# EAGLE schematic SonarBoardV2 (EAGLE 7.2.0)
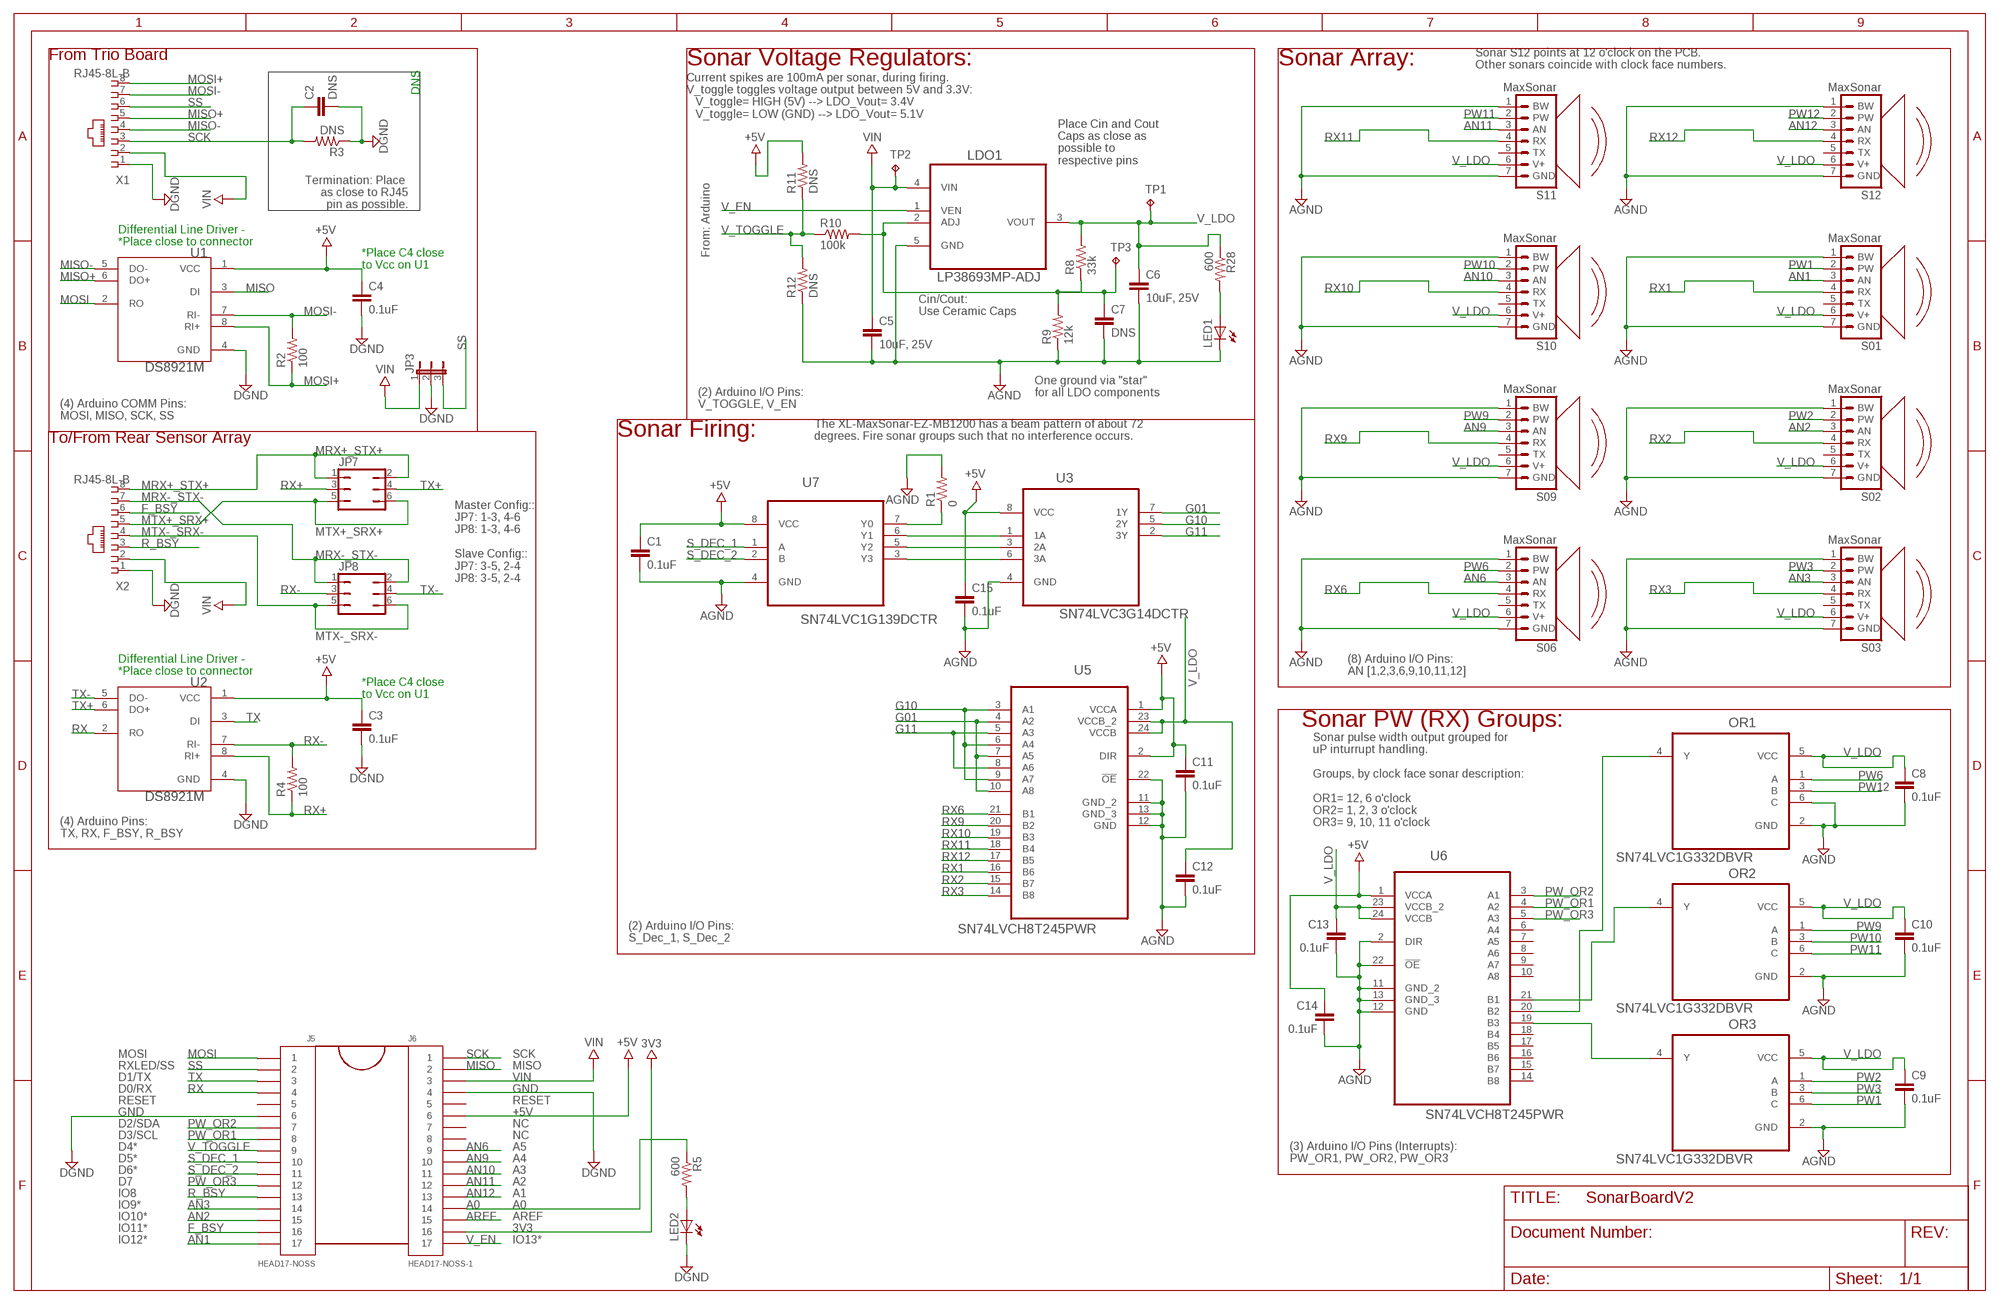
[diagram p0: schematic, sheet 1]

## Parts
C1  0.1uF  CAP0603-CAP  [0603-CAP]
C2  DNS  CAP0603-CAP  [0603-CAP]
C3  0.1uF  CAP0603-CAP  [0603-CAP]
C4  0.1uF  CAP0603-CAP  [0603-CAP]
C5  10uF, 25V  CAP0805  [0805]
C6  10uF, 25V  CAP0805  [0805]
C7  DNS  CAP0603-CAP  [0603-CAP]
C8  0.1uF  CAP0603-CAP  [0603-CAP]
C9  0.1uF  CAP0603-CAP  [0603-CAP]
C10  0.1uF  CAP0603-CAP  [0603-CAP]
C11  0.1uF  CAP0603-CAP  [0603-CAP]
C12  0.1uF  CAP0603-CAP  [0603-CAP]
C13  0.1uF  CAP0603-CAP  [0603-CAP]
C14  0.1uF  CAP0603-CAP  [0603-CAP]
C15  0.1uF  CAP0603-CAP  [0603-CAP]
J5  HEAD17-NOSS  [HEAD17-NOSS]
J6  HEAD17-NOSS-1  [HEAD17-NOSS-1]
JP3  JP2E  [JP2]
JP7  JP3Q  [JP3Q]
JP8  JP3Q  [JP3Q]
LDO1  LP38693MP-ADJ  [SOT150P696X180-5N]
LED1  LEDSML0603  [SML0603]
LED2  LEDSML0603  [SML0603]
OR1  SN74LVC1G332DBVR  [SOT95P280X145-6N]
OR2  SN74LVC1G332DBVR  [SOT95P280X145-6N]
OR3  SN74LVC1G332DBVR  [SOT95P280X145-6N]
R1  0  RESISTOR0603-RES  [0603-RES]
R2  100  R-US_R0805  [R0805]
R3  DNS  RESISTOR0603-RES  [0603-RES]
R4  100  R-US_R0805  [R0805]
R5  600  RESISTOR0603-RES  [0603-RES]
R8  33k  RESISTOR0603-RES  [0603-RES]
R9  12k  RESISTOR0603-RES  [0603-RES]
R10  100k  RESISTOR0603-RES  [0603-RES]
R11  DNS  RESISTOR0603-RES  [0603-RES]
R12  DNS  RESISTOR0603-RES  [0603-RES]
R28  600  RESISTOR0603-RES  [0603-RES]
S01  MaxSonar  XL-MAXSONAR-EDGE_MOUNT  [XL-MAXSONAR-PACKAGE]
S02  MaxSonar  XL-MAXSONAR-EDGE_MOUNT  [XL-MAXSONAR-PACKAGE]
S03  MaxSonar  XL-MAXSONAR-EDGE_MOUNT  [XL-MAXSONAR-PACKAGE]
S06  MaxSonar  XL-MAXSONAR-EDGE_MOUNT  [XL-MAXSONAR-PACKAGE]
S09  MaxSonar  XL-MAXSONAR-EDGE_MOUNT  [XL-MAXSONAR-PACKAGE]
S10  MaxSonar  XL-MAXSONAR-EDGE_MOUNT  [XL-MAXSONAR-PACKAGE]
S11  MaxSonar  XL-MAXSONAR-EDGE_MOUNT  [XL-MAXSONAR-PACKAGE]
S12  MaxSonar  XL-MAXSONAR-EDGE_MOUNT  [XL-MAXSONAR-PACKAGE]
TP1  TPPAD1-17  [P1-17]
TP2  TPPAD1-17  [P1-17]
TP3  TPPAD1-17  [P1-17]
U1  DS8921M  [SOIC127O620X175-8N]
U2  DS8921M  [SOIC127O620X175-8N]
U3  SN74LVC3G14DCTR  [SOP65P400X130-8N]
U5  SN74LVCH8T245PWR  [SOP65P640X120-24N]
U6  SN74LVCH8T245PWR  [SOP65P640X120-24N]
U7  SN74LVC1G139DCTR  [SOP65P400X130-8N@1]
X1  RJ45-8L-B  [RJ45-NO-SHIELD]
X2  RJ45-8L-B  [RJ45-NO-SHIELD]

## Nets
3V3: J6.16
+5V: C1.1 C3.1 C4.1 C11.1 C14.1 C15.1 J6.6 R11.2 U1.1(VCC) U2.1(VCC) U3.8(VCC) U5.1(VCCA) U5.2(DIR) U6.1(VCCA) U7.8(VCC)
A0: J6.14 R5.1
AN1: J5.17 S01.3(AN)
AN2: J5.15 S02.3(AN)
AN3: J5.14 S03.3(AN)
AN6: J6.9 S06.3(AN)
AN9: J6.10 S09.3(AN)
AN10: J6.11 S10.3(AN)
AN11: J6.12 S11.3(AN)
AN12: J6.13 S12.3(AN)
AREF: J6.15
F_BSY: J5.16 X2.6
G01: U3.7(1Y) U5.4(A2) U5.7(A5) U5.10(A8)
G10: U3.5(2Y) U5.3(A1) U5.6(A4) U5.9(A7)
G11: U3.2(3Y) U5.5(A3) U5.8(A6)
GND: C1.2 C2.2 C3.2 C4.2 C5.2 C6.2 C7.2 C8.2 C9.2 C10.2 C11.2 C12.2 C13.2 C14.2 C15.2 J5.6 J6.4 JP3.2 LDO1.5(GND) LED1.C LED2.C OR1.2(GND) OR1.6(C) OR2.2(GND) OR3.2(GND) R1.2 R3.1 R9.1 R12.1 S01.1(BW) S01.7(GND) S02.1(BW) S02.7(GND) S03.1(BW) S03.7(GND) S06.1(BW) S06.7(GND) S09.1(BW) S09.7(GND) S10.1(BW) S10.7(GND) S11.1(BW) S11.7(GND) S12.1(BW) S12.7(GND) U1.4(GND) U2.4(GND) U3.4(GND) U5.11(GND_2) U5.12(GND) U5.13(GND_3) U5.22(!OE) U6.2(DIR) U6.11(GND_2) U6.12(GND) U6.13(GND_3) U6.22(!OE) U7.4(GND) X1.1 X2.1 ; supply symbol labelled AGND, DGND
MISO: J6.2 U1.3(DI)
MISO+: U1.6(DO+) X1.5
MISO-: U1.5(DO-) X1.4
MOSI: J5.1 U1.2(RO)
MOSI+: R2.1 U1.8(RI+) X1.8
MOSI-: R2.2 U1.7(RI-) X1.7
MRX+_STX+: JP7.1 JP7.2 X2.8
MRX-_STX-: JP8.1 JP8.2 X2.7
MTX+_SRX+: JP7.5 JP7.6 X2.5
MTX-_SRX-: JP8.5 JP8.6 X2.4
N$2: LED2.A R5.2
N$14: LED1.A R28.2
N$15: U3.1(1A) U7.6(Y1)
N$18: U3.3(2A) U7.5(Y2)
N$19: U3.6(3A) U7.3(Y3)
N$20: R1.1 U7.7(Y0)
N$43: OR1.4(Y) U6.20(B2)
N$44: OR2.4(Y) U6.21(B1)
N$45: OR3.4(Y) U6.19(B3)
PW1: OR3.6(C) S01.2(PW)
PW2: OR3.1(A) S02.2(PW)
PW3: OR3.3(B) S03.2(PW)
PW6: OR1.1(A) S06.2(PW)
PW9: OR2.1(A) S09.2(PW)
PW10: OR2.3(B) S10.2(PW)
PW11: OR2.6(C) S11.2(PW)
PW12: OR1.3(B) S12.2(PW)
PW_OR1: J5.8 U6.4(A2)
PW_OR2: J5.7 U6.3(A1)
PW_OR3: J5.12 U6.5(A3)
R_BSY: J5.13 X2.3
RX: J5.4 U2.2(RO)
RX1: S01.4(RX) U5.16(B6)
RX2: S02.4(RX) U5.15(B7)
RX3: S03.4(RX) U5.14(B8)
RX6: S06.4(RX) U5.21(B1)
RX9: S09.4(RX) U5.20(B2)
RX10: S10.4(RX) U5.19(B3)
RX11: S11.4(RX) U5.18(B4)
RX12: S12.4(RX) U5.17(B5)
RX+: JP7.3 R4.1 U2.8(RI+)
RX-: JP8.3 R4.2 U2.7(RI-)
S_DEC_1: J5.10 U7.1(A)
S_DEC_2: J5.11 U7.2(B)
SCK: C2.1 J6.1 R3.2 X1.3
SS: J5.2 JP3.3 X1.6
TX: J5.3 U2.3(DI)
TX+: JP7.4 U2.6(DO+)
TX-: JP8.4 U2.5(DO-)
V_ADJ: C7.1 LDO1.2(ADJ) R8.1 R9.2 R10.2 TP3.TP
V_EN: J6.17 LDO1.1(VEN)
V_LDO: C6.1 C8.1 C9.1 C10.1 C12.1 C13.1 LDO1.3(VOUT) OR1.5(VCC) OR2.5(VCC) OR3.5(VCC) R8.2 R28.1 S01.6(V+) S02.6(V+) S03.6(V+) S06.6(V+) S09.6(V+) S10.6(V+) S11.6(V+) S12.6(V+) TP1.TP U5.23(VCCB_2) U5.24(VCCB) U6.23(VCCB_2) U6.24(VCCB)
V_TOGGLE: J5.9 R10.1 R11.1 R12.2
VIN: C5.1 J6.3 JP3.1 LDO1.4(VIN) TP2.TP X1.2 X2.2
Unconnected: J5.5 J6.5 J6.7 J6.8 S01.5(TX) S02.5(TX) S03.5(TX) S06.5(TX) S09.5(TX) S10.5(TX) S11.5(TX) S12.5(TX) U6.6(A4) U6.7(A5) U6.8(A6) U6.9(A7) U6.10(A8) U6.14(B8) U6.15(B7) U6.16(B6) U6.17(B5) U6.18(B4)

## Notes on the sheet
- From Trio Board | Sonar Voltage Regulators: | Sonar Array:
- Sonar S12 points at 12 o'clock on the PCB.
  Other sonars coincide with clock face numbers.
- DNS
- Current spikes are 100mA per sonar, during firing.
  V_toggle toggles voltage output between 5V and 3.3V:
     V_toggle= HIGH (5V) --> LDO_Vout= 3.4V
     V_toggle= LOW (GND) --> LDO_Vout= 5.1V
- Place Cin and Cout 
  Caps as close as 
  possible to 
  respective pins
- Termination: Place 
  as close to RJ45
  pin as possible.
- Differential Line Driver -
  *Place close to connector
- From: Arduino
- *Place C4 close 
  to Vcc on U1
- Cin/Cout:
  Use Ceramic Caps
- One ground via "star"
  for all LDO components
- (2) Arduino I/O Pins:
  V_TOGGLE, V_EN
- (4) Arduino COMM Pins:
  MOSI, MISO, SCK, SS
- Sonar Firing:
- The XL-MaxSonar-EZ-MB1200 has a beam pattern of about 72
  degrees. Fire sonar groups such that no interference occurs.
- To/From Rear Sensor Array
- Master Config::
  JP7: 1-3, 4-6
  JP8: 1-3, 4-6
  
  Slave Config::
  JP7: 3-5, 2-4
  JP8: 3-5, 2-4
- Differential Line Driver -
  *Place close to connector
- (8) Arduino I/O Pins: 
  AN [1,2,3,6,9,10,11,12]
- *Place C4 close 
  to Vcc on U1
- Sonar PW (RX) Groups:
- Sonar pulse width output grouped for 
  uP inturrupt handling.  
  
  Groups, by clock face sonar description:
  
  OR1= 12, 6 o'clock
  OR2= 1, 2, 3 o'clock
  OR3= 9, 10, 11 o'clock
- (4) Arduino Pins: 
  TX, RX, F_BSY, R_BSY
- (2) Arduino I/O Pins: 
  S_Dec_1, S_Dec_2
- MOSI | SCK
- RXLED/SS | MISO
- D1/TX | VIN
- D0/RX | GND
- RESET | RESET
- GND | +5V
- D2/SDA | NC
- D3/SCL | NC
- D4* | A5
- D5* | A4
- (3) Arduino I/O Pins (Interrupts): 
  PW_OR1, PW_OR2, PW_OR3
- D6* | A3
- D7 | A2
- IO8 | A1
- IO9* | A0
- IO10* | AREF
- IO11* | 3V3
- IO12* | IO13*

## Library data of the parts
C1-C15 = SparkFun-Passives:CAP: Capacitor Standard 0603 ceramic capacitor, and 0.1" leaded capacitor.
J5 = SmartPrj:HEAD17-NOSS
J6 = SmartPrj:HEAD17-NOSS-1
JP3 = jumper:JP2E: JUMPER
JP7 JP8 = jumper:JP3Q: JUMPER
LDO1 = ElcanoProject:LP38693MP-ADJ: IC, ADJ LDO REG, 1.25V TO 9V; MPN: LP38693MP-ADJ; OC_FARNELL: 1685718; OC_NEWARK: 41K7493; PACKAGE: SOT-223-5; SUPPLIER: NationalSemiconductor
LED1 LED2 = led:LED: LED OSRAM: - CHIPLED LG R971, LG N971, LY N971, LG Q971, LY Q971, LO R971, LY R971 LH N974, LH R974 LS Q976, LO Q976, LY Q976 LO Q996 - Hyper CHIPLED LW Q18S LB Q993, LB Q99A, LB R99A - SideLED LS A670, LO A670, LY A670, LG A670, LP A670 LB A673, LV A673, LT A673, LW A673 LH A674 LY A675 LS A676, LA A676, LO A676, LY A676, LW A676 LS A679, LY A679, LG A679 - Hyper Micro SIDELED® LS Y876, LA Y876, LO Y876, LY Y876 LT Y87S - SmartLED LW L88C, LW L88S LB L89C, LB L89S, LG L890 LS L89K, LO L89K, LY L89K LS L896, LA L896, LO L896, LY L896 - TOPLED LS T670, LO T670, LY T670, LG T670, LP T670 LSG T670, LSP T670, LSY T670, LOP T670, LYG T670 LG T671, LOG T671, LSG T671 LB T673, LV T673, LT T673, LW T673 LH T674 LS T676, LA T676, LO T676, LY T676, LB T676, LH T676, LSB T676, LW T676 LB T67C, LV T67C, LT T67C, LS T67K, LO T67K, LY T67K, LW E67C LS E67B, LA E67B, LO E67B, LY E67B, LB E67C, LV E67C, LT E67C LW T67C LS T679, LY T679, LG T679 LS T770, LO T770, LY T770, LG T770, LP T770 LB T773, LV T773, LT T773, LW T773 LH T774 LS E675, LA E675, LY E675, LS T675 LS T776, LA T776, LO T776, LY T776, LB T776 LHGB T686 LT T68C, LB T68C - Hyper Mini TOPLED® LB M676 - Mini TOPLED Santana® LG M470 LS M47K, LO M47K, LY M47K Source: http://www.osram.convergy.de LUXEON: - LUMILED® LXK2-PW12-R00, LXK2-PW12-S00, LXK2-PW14-U00, LXK2-PW14-V00 LXK2-PM12-R00, LXK2-PM12-S00, LXK2-PM14-U00 LXK2-PE12-Q00, LXK2-PE12-R00, LXK2-PE12-S00, LXK2-PE14-T00, LXK2-PE14-U00 LXK2-PB12-K00, LXK2-PB12-L00, LXK2-PB12-M00, LXK2-PB14-N00, LXK2-PB14-P00, LXK2-PB14-Q00 LXK2-PR12-L00, LXK2-PR12-M00, LXK2-PR14-Q00, LXK2-PR14-R00 LXK2-PD12-Q00, LXK2-PD12-R00, LXK2-PD12-S00 LXK2-PH12-R00, LXK2-PH12-S00 LXK2-PL12-P00, LXK2-PL12-Q00, LXK2-PL12-R00 Source: www.luxeon.com KINGBRIGHT: KA-3528ASYC Source: www.kingbright.com
OR1-OR3 = ElcanoProject:SN74LVC1G332DBVR: SINGLE 3-INPUT POSITIVE-OR GATE; MPN: SN74LVC1G332DBVR; OC_FARNELL: 1410355; OC_NEWARK: 87H2663; PACKAGE: SOT-23-6; SUPPLIER: TEXAS INSTRUMENTS
R1 R3 R5 R8-R12 R28 = SparkFun-Passives:RESISTOR: Resistor Basic schematic elements and footprints for 0603, 1206, and PTH resistors.
R2 R4 = rcl:R-US_: RESISTOR, American symbol
S01-S03 S06 S09 S10-S12 = ElcanoProject:XL-MAXSONAR
TP1-TP3 = testpad:TP: Test pad
U1 U2 = ElcanoProject:DS8921M: Differential Line Driver; MPN: DS8921M; OC_FARNELL: -; OC_NEWARK: 41K1928; PACKAGE: SOIC-8; SUPPLIER: National Semiconductor
U3 = ElcanoProject:SN74LVC3G14DCTR: TRIPLE SCHMITT-TRIGGER INVERTER; MPN: SN74LVC3G14DCTR; OC_FARNELL: -; OC_NEWARK: 76C4267; PACKAGE: SSOP-8; SUPPLIER: TEXAS INSTRUMENTS
U5 U6 = ElcanoProject:SN74LVCH8T245PWR: 8-BIT DUAL-SUPPLY BUS TRANSCEIVER, TSSOP-24; MPN: SN74LVCH8T245PWR; OC_FARNELL: 2120445; OC_NEWARK: 94T5041; PACKAGE: TSSOP-24; SUPPLIER: TEXAS INSTRUMENTS
U7 = ElcanoProject:SN74LVC1G139DCTR: 2-TO-4 LINE DECODER,SSOP-8; MPN: SN74LVC1G139DCTR; OC_FARNELL: Unknown; OC_NEWARK: 94T5046; PACKAGE: SSOP-8; SUPPLIER: TEXAS INSTRUMENTS
X1 X2 = con-tycoelectronics:RJ45: CORCOM Modular RJ Jacks No Shield Source: www.tycoelectronics.com .. ENG_DS_1654001_1099_RJ_L_0507.pdf; MF: TYCO ELECTRONICS; MPN: RJ45-8L-B; OC_FARNELL: 1279843; OC_NEWARK: 52K4445

## Net classes
0 default: width 0.254 mm, drill 0.508 mm, clearance 0.203 mm